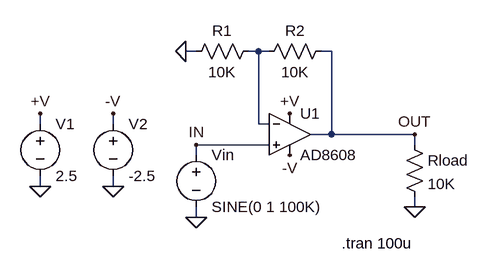
[diagram p0: schematic AD8608.asc]
AD8608.asc, the LTspice schematic file:
Version 4
SHEET 1 1240 700
WIRE 320 -1104 304 -1104
WIRE 416 -1104 400 -1104
WIRE 432 -1104 416 -1104
WIRE 528 -1104 512 -1104
WIRE 80 -992 80 -1008
WIRE 192 -992 192 -1008
WIRE 416 -992 416 -1104
WIRE 432 -992 416 -992
WIRE 528 -976 528 -1104
WIRE 528 -976 496 -976
WIRE 656 -976 528 -976
WIRE 432 -960 320 -960
WIRE 656 -960 656 -976
WIRE 320 -944 320 -960
WIRE 80 -896 80 -912
WIRE 192 -896 192 -912
WIRE 656 -864 656 -880
WIRE 320 -848 320 -864
FLAG 80 -1008 +V
FLAG 80 -896 0
FLAG 320 -848 0
FLAG 656 -976 OUT
FLAG 320 -960 IN
FLAG 464 -1008 +V
FLAG 192 -1008 -V
FLAG 464 -944 -V
FLAG 304 -1104 0
FLAG 656 -864 0
FLAG 192 -896 0
SYMBOL voltage 320 -960 R0
WINDOW 123 24 146 Left 2
WINDOW 39 24 125 Left 2
SYMATTR InstName Vin
SYMATTR Value SINE(0 1 100K)
SYMBOL Opamps\\AD8608 464 -1040 R0
SYMATTR InstName U1
SYMBOL voltage 80 -1008 R0
WINDOW 123 0 0 Left 2
WINDOW 39 0 0 Left 2
SYMATTR InstName V1
SYMATTR Value 2.5
SYMBOL res 416 -1120 R90
WINDOW 0 0 56 VBottom 2
WINDOW 3 32 56 VTop 2
SYMATTR InstName R1
SYMATTR Value 10K
SYMBOL res 528 -1120 R90
WINDOW 0 0 56 VBottom 2
WINDOW 3 32 56 VTop 2
SYMATTR InstName R2
SYMATTR Value 10K
SYMBOL voltage 192 -1008 R0
WINDOW 123 24 146 Left 2
WINDOW 39 24 125 Left 2
SYMATTR InstName V2
SYMATTR Value -2.5
SYMBOL res 640 -976 R0
SYMATTR InstName Rload
SYMATTR Value 10K
TEXT 544 -808 Left 2 !.tran 100u

The netlist it stands for:
* AD8608.asc
Vin IN 0 SINE(0 1 100K)
XU1 IN N001 +V -V OUT AD8608  ; pins In+ In- V+ V- OUT
V1 +V 0 2.5
R1 N001 0 10K
R2 OUT N001 10K
V2 -V 0 -2.5
Rload OUT 0 10K
.tran 100u
.backanno
.end